# EAGLE schematic NEW MEIN (EAGLE 9.6.2)

## Sheet 1 of 6
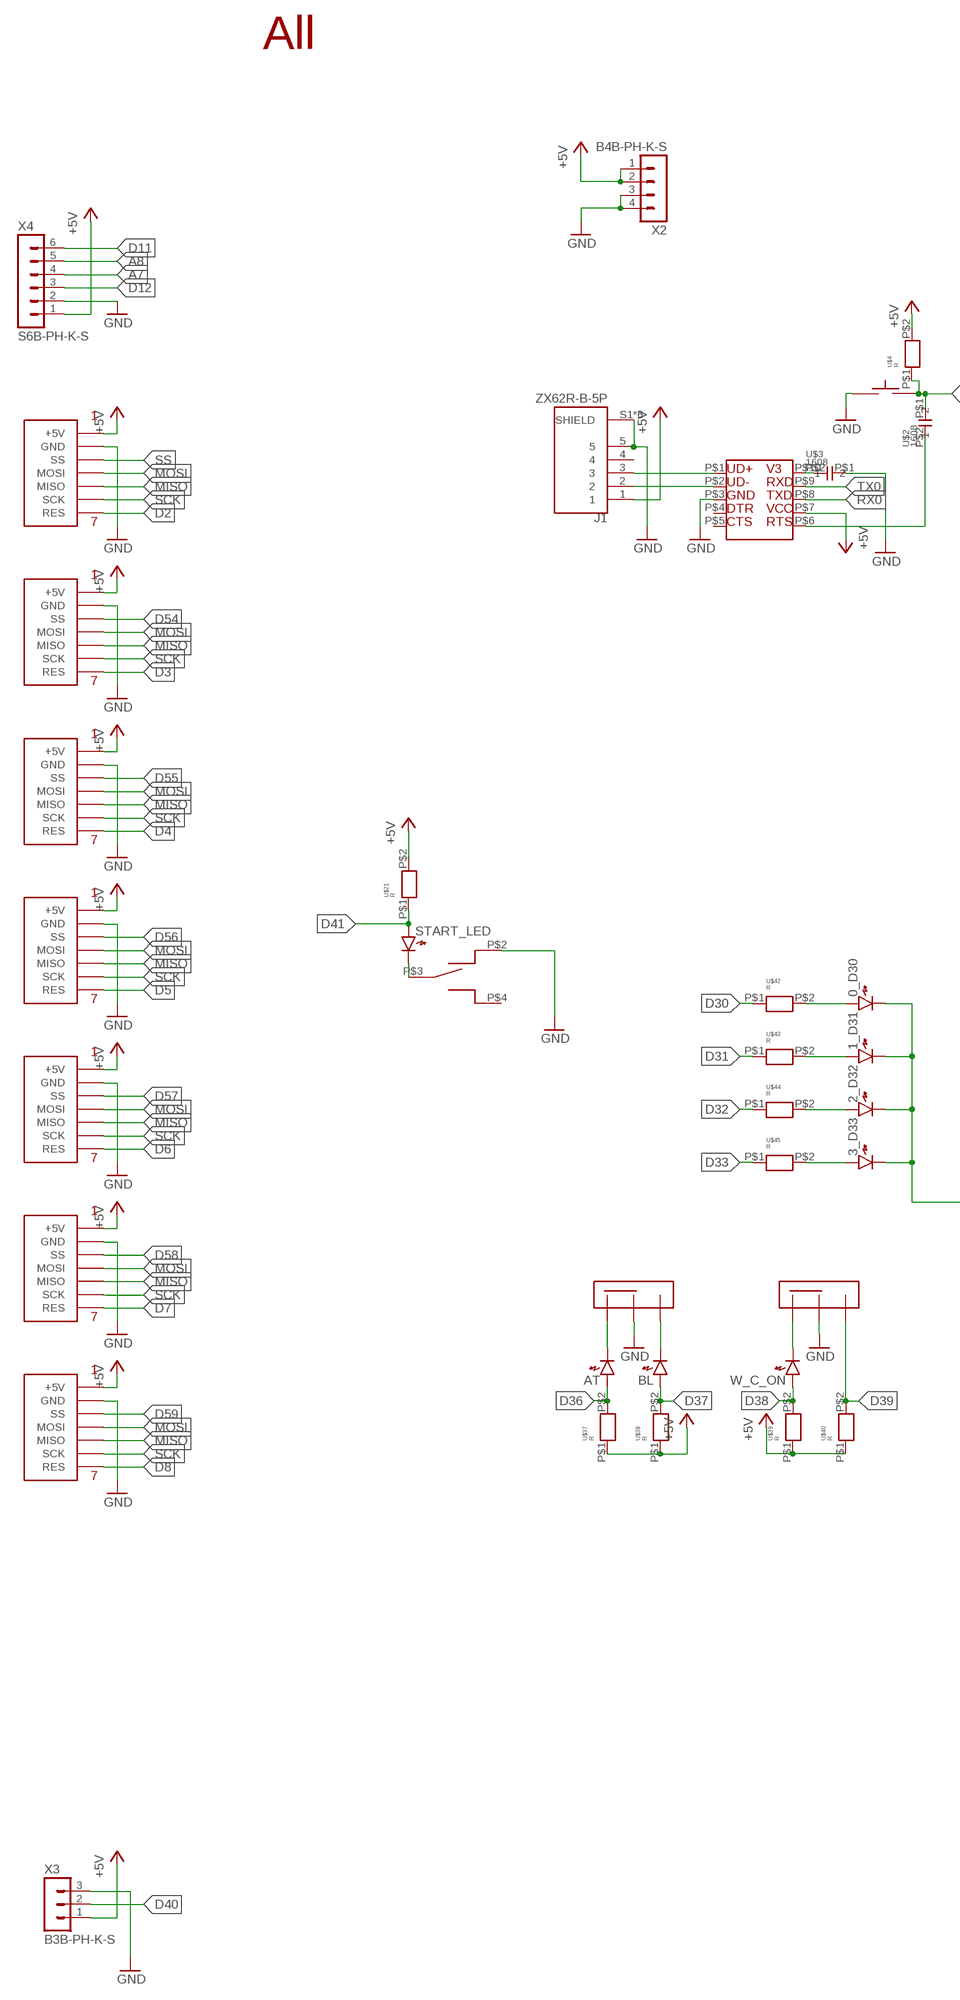
[diagram p0: schematic, sheet 1, part 1 of 2]
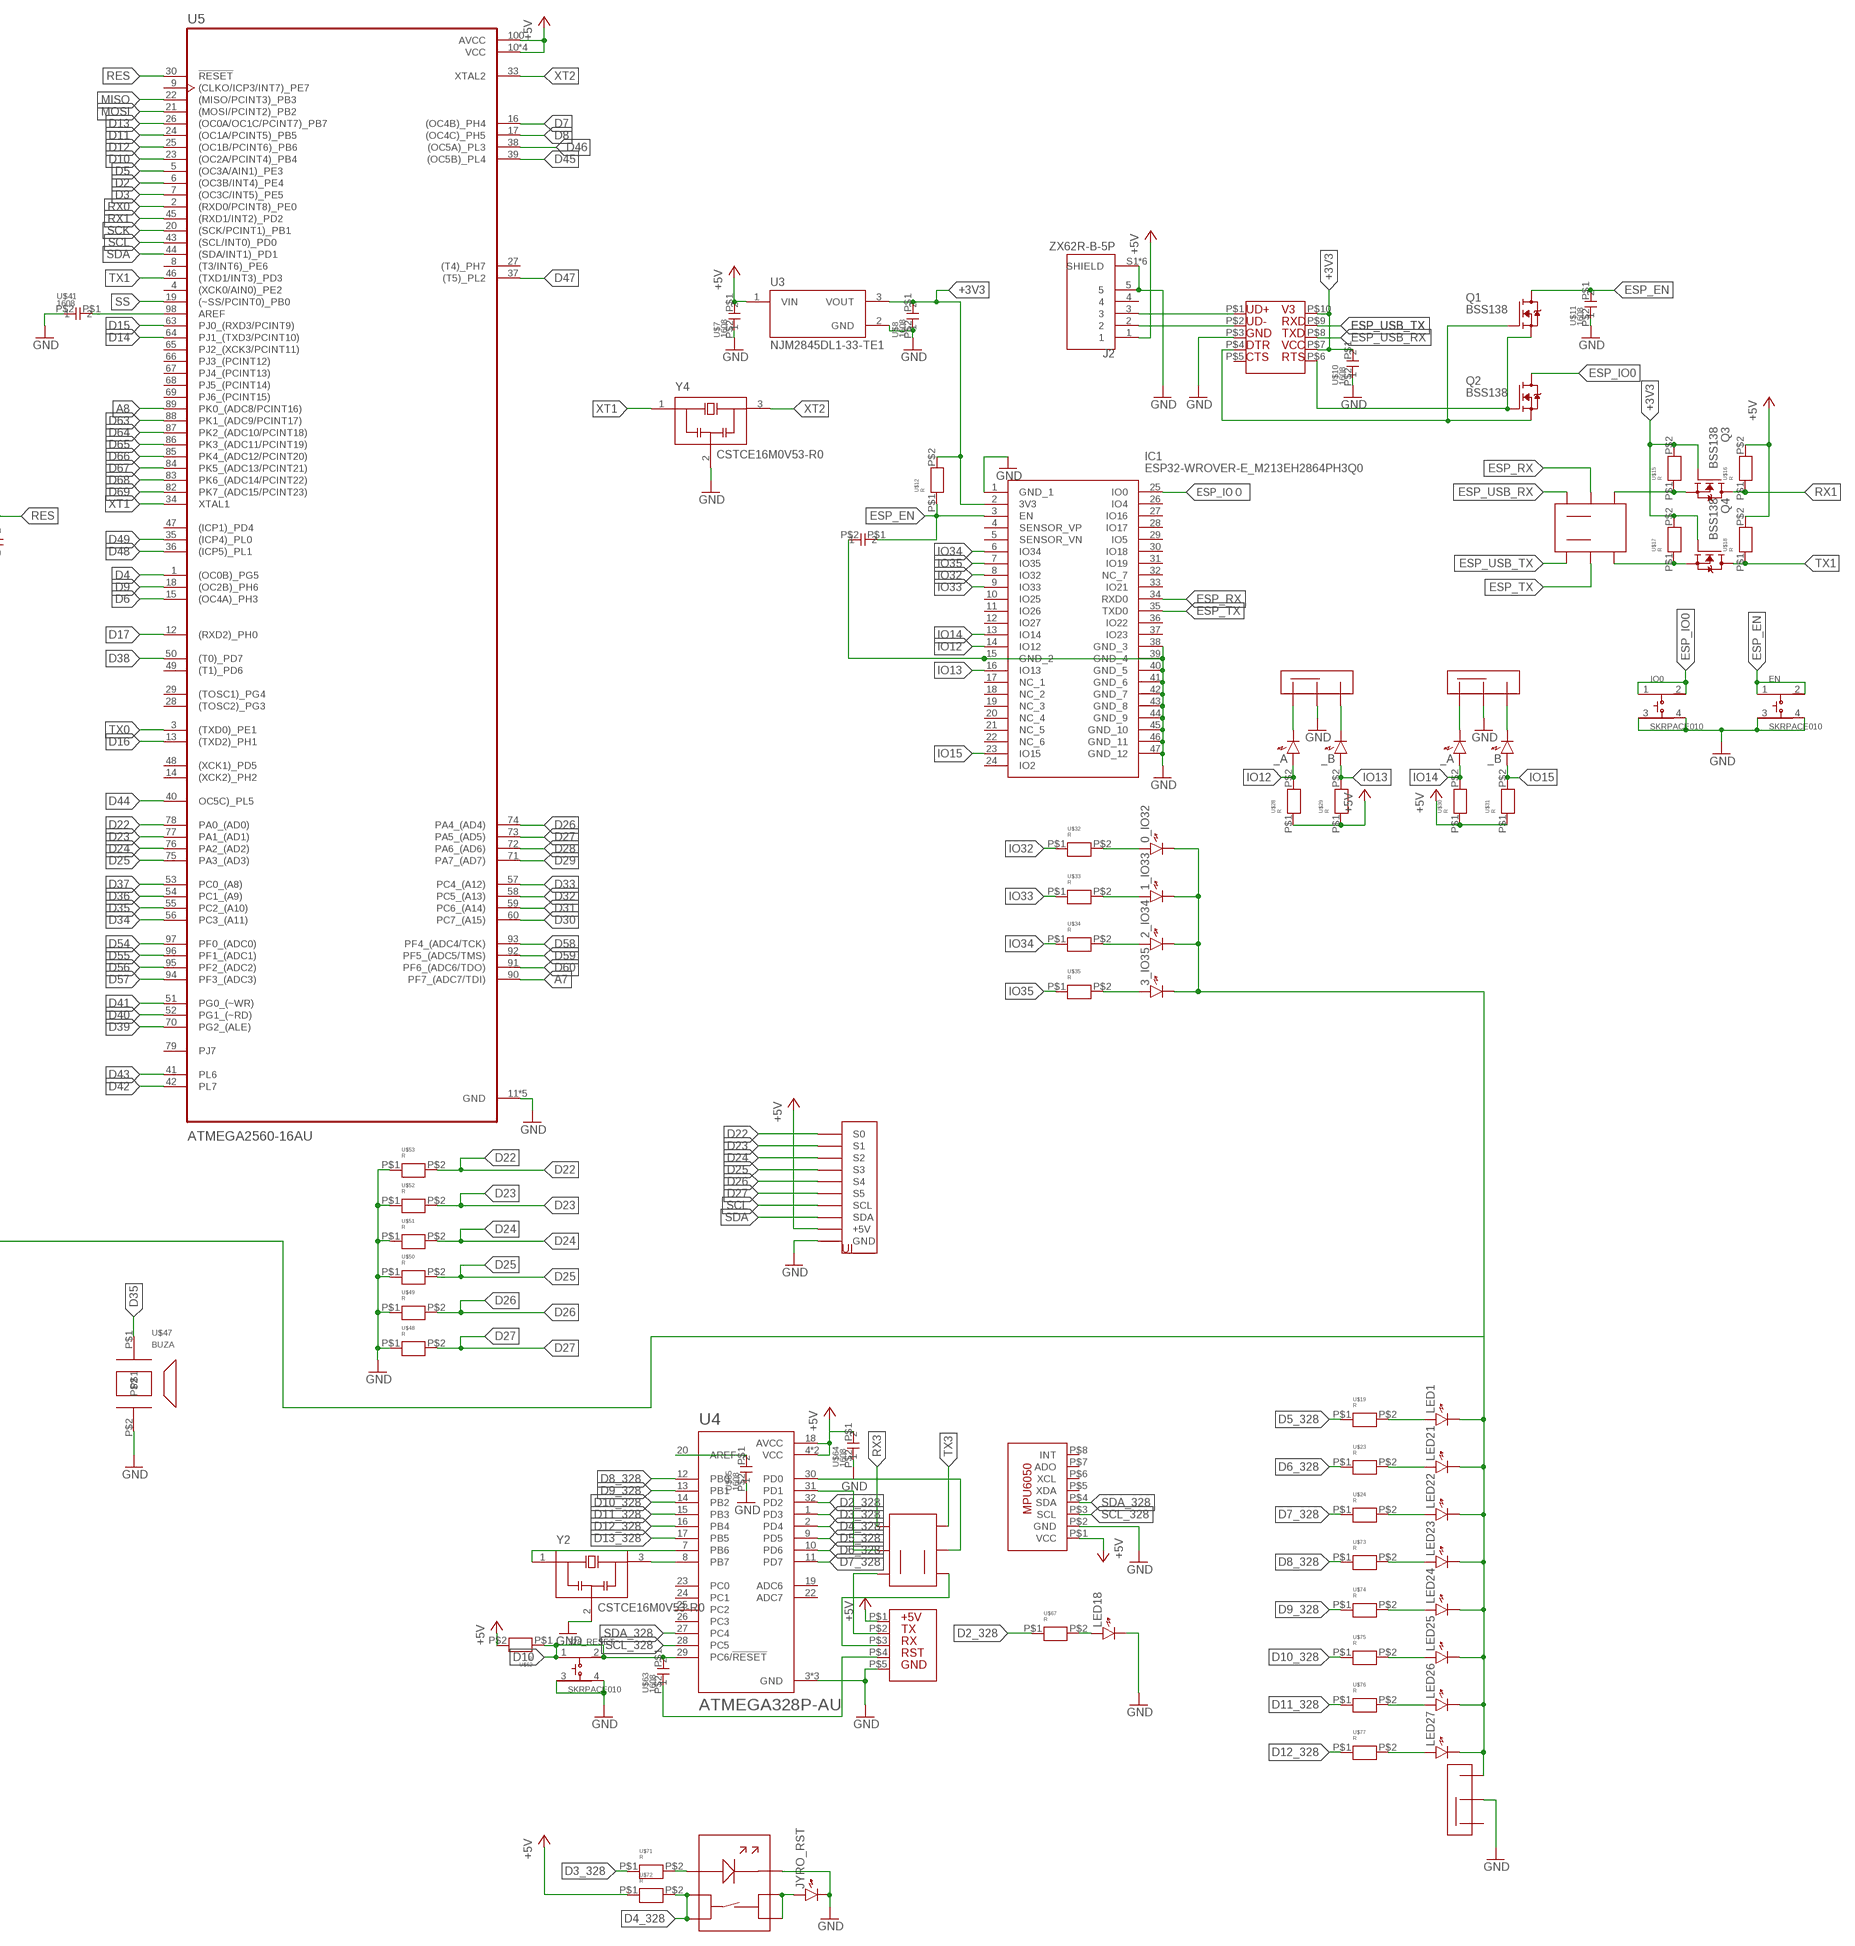
[diagram p1: schematic, sheet 1, part 2 of 2]

### Parts
0_D30  LED1608  [LED1608]
0_IO32  LED1608  [LED1608]
1_D31  LED1608  [LED1608]
1_IO33  LED1608  [LED1608]
2_D32  LED1608  [LED1608]
2_IO34  LED1608  [LED1608]
3_D33  LED1608  [LED1608]
3_IO35  LED1608  [LED1608]
328_RESET  SKRPACE010  [SW_SKRPACE010]
AT  LED1608  [LED1608]
BL  LED1608  [LED1608]
EN  SKRPACE010  [SW_SKRPACE010]
IC1  ESP32-WROVER-E_M213EH2864PH3Q0  [ESP32WROVEREM213EH2864PH3Q0]
IO0  SKRPACE010  [SW_SKRPACE010]
J1  ZX62R-B-5P  [HRS_ZX62R-B-5P]
J2  ZX62R-B-5P  [HRS_ZX62R-B-5P]
JYRO_RST  LED1608  [LED1608]
LED1  LED1608  [LED1608]
LED18  LED1608  [LED1608]
LED21  LED1608  [LED1608]
LED22  LED1608  [LED1608]
LED23  LED1608  [LED1608]
LED24  LED1608  [LED1608]
LED25  LED1608  [LED1608]
LED26  LED1608  [LED1608]
LED27  LED1608  [LED1608]
Q1  BSS138  [SOT23]
Q2  BSS138  [SOT23]
Q3  BSS138  [SOT23]
Q4  BSS138  [SOT23]
START_LED  LED1608  [LED1608]
U3  NJM2845DL1-33-TE1  [DPAK228P968X238-4N]
U4  ATMEGA328P-AU  [QFP80P900X900X120-32N]
U5  ATMEGA2560-16AU  [QFP50P1600X1600X120-100N]
U$1  CH340K  [CH340K]
U$2  1608  [CON]
U$3  1608  [CON]
U$4  R  [1608]
U$5  ALL  [ALL]
U$6  TAKUTO  [12]
U$7  1608  [CON]
U$8  1608  [CON]
U$9  CH340K  [CH340K]
U$10  1608  [CON]
U$11  1608  [CON]
U$12  R  [1608]
U$13  1608  [CON]
U$14  2SW  [2SW]
U$15  R  [1608]
U$16  R  [1608]
U$17  R  [1608]
U$18  R  [1608]
U$19  R  [1608]
U$20  S  [S]
U$21  R  [1608]
U$22  SSW  [SSW]
U$23  R  [1608]
U$24  R  [1608]
U$25  ジャイロ  [ジャイロ]
U$26  SSW  [SSW]
U$27  SSW  [SSW]
U$28  R  [1608]
U$29  R  [1608]
U$30  R  [1608]
U$31  R  [1608]
U$32  R  [1608]
U$33  R  [1608]
U$34  R  [1608]
U$35  R  [1608]
U$36  SSW  [SSW]
U$37  R  [1608]
U$38  R  [1608]
U$39  R  [1608]
U$40  R  [1608]
U$41  1608  [CON]
U$42  R  [1608]
U$43  R  [1608]
U$44  R  [1608]
U$45  R  [1608]
U$47  BUZA  [BUZA]
U$48  R  [1608]
U$49  R  [1608]
U$50  R  [1608]
U$51  R  [1608]
U$52  R  [1608]
U$53  R  [1608]
U$54  SPI  [SPI]
U$55  SPI  [SPI]
U$56  SPI  [SPI]
U$57  SPI  [SPI]
U$58  SPI  [SPI]
U$59  SPI  [SPI]
U$60  SPI  [SPI]
U$62  R  [1608]
U$63  1608  [CON]
U$64  1608  [CON]
U$65  1608  [CON]
U$66  SI  [SI]
U$67  R  [1608]
U$68  UI  [UI]
U$69  2SW  [2SW]
U$70  SWLED  [SWLED]
U$71  R  [1608]
U$72  R  [1608]
U$73  R  [1608]
U$74  R  [1608]
U$75  R  [1608]
U$76  R  [1608]
U$77  R  [1608]
U$78  SSW  [SSW]
W_C_ON  LED1608  [LED1608]
X2  B4B-PH-K-S  [B4B-PH-K-S]
X3  B3B-PH-K-S  [B3B-PH-K-S]
X4  S6B-PH-K-S  [S6B-PH-K-S]
Y2  CSTCE16M0V53-R0  [OSC_CSTCE16M0V53-R0]
Y4  CSTCE16M0V53-R0  [OSC_CSTCE16M0V53-R0]
Ⅰ_A  LED1608  [LED1608]
Ⅰ_B  LED1608  [LED1608]
Ⅱ_A  LED1608  [LED1608]
Ⅱ_B  LED1608  [LED1608]

### Nets
+3V3: IC1.2(3V3) Q3.1(G) Q4.1(G) U3.3(VOUT) U$8.P$1 U$9.P$7 U$9.P$10 U$10.P$1 U$12.P$2 U$15.P$2 U$17.P$2
+5V: J1.1 J2.1 U3.1(VIN) U4.4(VCC) U4.6(VCC) U4.18(AVCC) U5.10(VCC) U5.31(VCC) U5.61(VCC) U5.80(VCC) U5.100(AVCC) U$1.P$7 U$4.P$2 U$7.P$1 U$16.P$2 U$18.P$2 U$21.P$2 U$25.P$1(VCC) U$28.P$1 U$29.P$1 U$30.P$1 U$31.P$1 U$37.P$1 U$38.P$1 U$39.P$1 U$40.P$1 U$54.P$1(+5V) U$55.P$1(+5V) U$56.P$1(+5V) U$57.P$1(+5V) U$58.P$1(+5V) U$59.P$1(+5V) U$60.P$1(+5V) U$62.P$2 U$64.P$1 U$66.P$1 U$68.P$1(+5V) U$72.P$1 X2.1 X2.2 X3.1 X4.1
A7: U5.90(PF7_(ADC7/TDI)) X4.4
A8: U5.89(PK0_(ADC8/PCINT16)) X4.5
D2: U5.6((OC3B/INT4)_PE4) U$54.P$7(RES)
D2_328: U4.32(PD2) U$67.P$1
D3: U5.7((OC3C/INT5)_PE5) U$55.P$7(RES)
D3_328: U4.1(PD3) U$71.P$1
D4: U5.1((OC0B)_PG5) U$56.P$7(RES)
D4_328: U4.2(PD4) U$70.1 U$70.2 U$72.P$2
D5: U5.5((OC3A/AIN1)_PE3) U$57.P$7(RES)
D5_328: U4.9(PD5) U$19.P$1
D6: U5.15((OC4A)_PH3) U$58.P$7(RES)
D6_328: U4.10(PD6) U$23.P$1
D7: U5.16((OC4B)_PH4) U$59.P$7(RES)
D7_328: U4.11(PD7) U$24.P$1
D8: U5.17((OC4C)_PH5) U$60.P$7(RES)
D8_328: U4.12(PB0) U$73.P$1
D9: U5.18((OC2B)_PH6)
D9_328: U4.13(PB1) U$74.P$1
D10: 328_RESET.1 328_RESET.2 U4.29(PC6/!RESET) U5.23((OC2A/PCINT4)_PB4) U$62.P$1 U$63.P$1
D10_328: U4.14(PB2) U$75.P$1
D11: U5.24((OC1A/PCINT5)_PB5) X4.6
D11_328: U4.15(PB3) U$76.P$1
D12: U5.25((OC1B/PCINT6)_PB6) X4.3
D12_328: U4.16(PB4) U$77.P$1
D13: U5.26((OC0A/OC1C/PCINT7)_PB7)
D13_328: U4.17(PB5)
D14: U5.64(PJ1_(TXD3/PCINT10))
D15: U5.63(PJ0_(RXD3/PCINT9))
D16: U5.13((TXD2)_PH1)
D17: U5.12((RXD2)_PH0)
D22: U5.78(PA0_(AD0)) U$53.P$2 U$68.P$3(S0)
D23: U5.77(PA1_(AD1)) U$52.P$2 U$68.P$4(S1)
D24: U5.76(PA2_(AD2)) U$51.P$2 U$68.P$5(S2)
D25: U5.75(PA3_(AD3)) U$50.P$2 U$68.P$6(S3)
D26: U5.74(PA4_(AD4)) U$49.P$2 U$68.P$7(S4)
D27: U5.73(PA5_(AD5)) U$48.P$2 U$68.P$8(S5)
D28: U5.72(PA6_(AD6))
D29: U5.71(PA7_(AD7))
D30: U5.60(PC7_(A15)) U$42.P$1
D31: U5.59(PC6_(A14)) U$43.P$1
D32: U5.58(PC5_(A13)) U$44.P$1
D33: U5.57(PC4_(A12)) U$45.P$1
D34: U5.56(PC3_(A11))
D35: U5.55(PC2_(A10)) U$47.P$1
D36: AT.A U5.54(PC1_(A9)) U$37.P$2
D37: BL.A U5.53(PC0_(A8)) U$38.P$2
D38: U5.50((T0)_PD7) U$39.P$2 W_C_ON.A
D39: U5.70(PG2_(ALE)) U$36.P$2 U$40.P$2
D40: U5.52(PG1_(~RD)) X3.2
D41: START_LED.A U5.51(PG0_(~WR)) U$21.P$1
D42: U5.42(PL7)
D43: U5.41(PL6)
D44: U5.40(OC5C)_PL5)
D45: U5.39((OC5B)_PL4)
D46: U5.38((OC5A)_PL3)
D47: U5.37((T5)_PL2)
D48: U5.36((ICP5)_PL1)
D49: U5.35((ICP4)_PL0)
D54: U5.97(PF0_(ADC0)) U$55.P$3(SS)
D55: U5.96(PF1_(ADC1)) U$56.P$3(SS)
D56: U5.95(PF2_(ADC2)) U$57.P$3(SS)
D57: U5.94(PF3_(ADC3)) U$58.P$3(SS)
D58: U5.93(PF4_(ADC4/TCK)) U$59.P$3(SS)
D59: U5.92(PF5_(ADC5/TMS)) U$60.P$3(SS)
D60: U5.91(PF6_(ADC6/TDO))
D63: U5.88(PK1_(ADC9/PCINT17))
D64: U5.87(PK2_(ADC10/PCINT18))
D65: U5.86(PK3_(ADC11/PCINT19))
D66: U5.85(PK4_(ADC12/PCINT20))
D67: U5.84(PK5_(ADC13/PCINT21))
D68: U5.83(PK6_(ADC14/PCINT22))
D69: U5.82(PK7_(ADC15/PCINT23))
ESP_EN: EN.1 EN.2 IC1.3(EN) Q1.3(D) U$11.P$1 U$12.P$1 U$13.P$1
ESP_IO0: IO0.1 IO0.2 Q2.3(D)
ESP_IO０: IC1.25(IO0)
ESP_RX: IC1.34(RXD0) U$14.P$2
ESP_TX: IC1.35(TXD0) U$14.P$5
ESP_USB_RX: U$9.P$8 U$14.P$1
ESP_USB_TX: U$9.P$9 U$14.P$6
GND: 328_RESET.3 328_RESET.4 EN.3 EN.4 IC1.1(GND_1) IC1.15(GND_2) IC1.38(GND_3) IC1.39(GND_4) IC1.40(GND_5) IC1.41(GND_6) IC1.42(GND_7) IC1.43(GND_8) IC1.44(GND_9) IC1.45(GND_10) IC1.46(GND_11) IC1.47(GND_12) IO0.3 IO0.4 J1.5 J1.S1(SHIELD) J1.S2(SHIELD) J1.S3(SHIELD) J1.S4(SHIELD) J1.S5(SHIELD) J1.S6(SHIELD) J2.5 J2.S1(SHIELD) J2.S2(SHIELD) J2.S3(SHIELD) J2.S4(SHIELD) J2.S5(SHIELD) J2.S6(SHIELD) JYRO_RST.K LED18.K U3.2(GND) U4.3(GND) U4.5(GND) U4.21(GND) U5.11(GND) U5.32(GND) U5.62(GND) U5.81(GND) U5.99(GND) U$1.P$3 U$3.P$1 U$6.P$1 U$6.P$4 U$7.P$2 U$8.P$2 U$9.P$3 U$10.P$2 U$11.P$2 U$13.P$2 U$20.P$2 U$22.P$3 U$25.P$2(GND) U$26.P$3 U$27.P$3 U$36.P$3 U$41.P$2 U$47.P$2 U$48.P$1 U$49.P$1 U$50.P$1 U$51.P$1 U$52.P$1 U$53.P$1 U$54.P$2(GND) U$55.P$2(GND) U$56.P$2(GND) U$57.P$2(GND) U$58.P$2(GND) U$59.P$2(GND) U$60.P$2(GND) U$64.P$2 U$65.P$2 U$66.P$5 U$68.P$2(GND) U$70.-(LED-) U$78.P$3 X2.3 X2.4 X3.3 X4.2 Y2.2(GND) Y4.2(GND)
IO12: IC1.14(IO12) U$28.P$2 Ⅰ_A.A
IO13: IC1.16(IO13) U$29.P$2 Ⅰ_B.A
IO14: IC1.13(IO14) U$30.P$2 Ⅱ_A.A
IO15: IC1.23(IO15) U$31.P$2 Ⅱ_B.A
IO32: IC1.8(IO32) U$32.P$1
IO33: IC1.9(IO33) U$33.P$1
IO34: IC1.6(IO34) U$34.P$1
IO35: IC1.7(IO35) U$35.P$1
MISO: U5.22((MISO/PCINT3)_PB3) U$54.P$5(MISO) U$55.P$5(MISO) U$56.P$5(MISO) U$57.P$5(MISO) U$58.P$5(MISO) U$59.P$5(MISO) U$60.P$5(MISO)
MOSI: U5.21((MOSI/PCINT2)_PB2) U$54.P$4(MOSI) U$55.P$4(MOSI) U$56.P$4(MOSI) U$57.P$4(MOSI) U$58.P$4(MOSI) U$59.P$4(MOSI) U$60.P$4(MOSI)
N$1: U$1.P$6 U$2.P$2
N$5: U4.20(AREF) U$65.P$1
N$7: U5.98(AREF) U$41.P$1
N$9: J1.2 U$1.P$2
N$10: J1.3 U$1.P$1
N$11: LED1.A U$19.P$2
N$12: 0_D30.K 0_IO32.K 1_D31.K 1_IO33.K 2_D32.K 2_IO34.K 3_D33.K 3_IO35.K LED1.K LED21.K LED22.K LED23.K LED24.K LED25.K LED26.K LED27.K U$78.P$2
N$13: LED21.A U$23.P$2
N$14: U$1.P$10 U$3.P$2
N$15: START_LED.K U$20.P$3
N$16: U$63.P$2 U$66.P$4
N$17: Q1.1(G) Q2.2(S) U$9.P$4
N$18: Q1.2(S) Q2.1(G) U$9.P$6
N$19: AT.K U$22.P$1
N$20: BL.K U$22.P$2
N$21: U4.31(PD1) U$69.P$2
N$22: J2.2 U$9.P$2
N$23: J2.3 U$9.P$1
N$24: U$26.P$1 Ⅰ_A.K
N$25: U$26.P$2 Ⅰ_B.K
N$26: U$66.P$3 U$69.P$6
N$27: U$27.P$1 Ⅱ_A.K
N$28: U$27.P$2 Ⅱ_B.K
N$29: U4.8(PB7) Y2.3(OUT)
N$30: U4.7(PB6) Y2.1(IN)
N$31: U$36.P$1 W_C_ON.K
N$33: 0_D30.A U$42.P$2
N$34: 0_IO32.A U$32.P$2
N$35: 1_IO33.A U$33.P$2
N$36: 2_IO34.A U$34.P$2
N$37: 3_IO35.A U$35.P$2
N$38: LED18.A U$67.P$2
N$39: U$66.P$2 U$69.P$1
N$40: U4.30(PD0) U$69.P$5
N$42: 1_D31.A U$43.P$2
N$43: 2_D32.A U$44.P$2
N$44: 3_D33.A U$45.P$2
N$46: JYRO_RST.A U$70.3 U$70.4
N$47: U$70.+(LED+) U$71.P$2
N$48: LED22.A U$24.P$2
N$49: LED23.A U$73.P$2
N$51: LED24.A U$74.P$2
N$52: LED25.A U$75.P$2
N$53: LED26.A U$76.P$2
N$54: LED27.A U$77.P$2
RES: U5.30(!RESET) U$2.P$1 U$4.P$1 U$6.P$2 U$6.P$3
RX0: U5.2((RXD0/PCINT8)_PE0) U$1.P$8
RX1: Q3.2(S) Q3.3(D) U5.45((RXD1/INT2)_PD2) U$14.P$3 U$15.P$1 U$16.P$1
RX3: U$69.P$3
SCK [New Class]: U5.20((SCK/PCINT1)_PB1) U$54.P$6(SCK) U$55.P$6(SCK) U$56.P$6(SCK) U$57.P$6(SCK) U$58.P$6(SCK) U$59.P$6(SCK) U$60.P$6(SCK)
SCL: U5.43((SCL/INT0)_PD0) U$68.P$9(SCL)
SCL_328: U4.28(PC5) U$25.P$3(SCL)
SDA: U5.44((SDA/INT1)_PD1) U$68.P$10(SDA)
SDA_328: U4.27(PC4) U$25.P$4(SDA)
SS: U5.19((~SS/PCINT0)_PB0) U$54.P$3(SS)
TX0: U5.3((TXD0)_PE1) U$1.P$9
TX1: Q4.2(S) Q4.3(D) U5.46((TXD1/INT3)_PD3) U$14.P$4 U$17.P$1 U$18.P$1
TX3: U$69.P$4
XT1: U5.34(XTAL1) Y4.1(IN)
XT2: U5.33(XTAL2) Y4.3(OUT)
Unconnected: IC1.4(SENSOR_VP) IC1.5(SENSOR_VN) IC1.10(IO25) IC1.11(IO26) IC1.12(IO27) IC1.17(NC_1) IC1.18(NC_2) IC1.19(NC_3) IC1.20(NC_4) IC1.21(NC_5) IC1.22(NC_6) IC1.24(IO2) IC1.26(IO4) IC1.27(IO16) IC1.28(IO17) IC1.29(IO5) IC1.30(IO18) IC1.31(IO19) IC1.32(NC_7) IC1.33(IO21) IC1.36(IO22) IC1.37(IO23) J1.4 J2.4 U4.19(ADC6) U4.22(ADC7) U4.23(PC0) U4.24(PC1) U4.25(PC2) U4.26(PC3) U5.4((XCK0/AIN0)_PE2) U5.8((T3/INT6)_PE6) U5.9((CLKO/ICP3/INT7)_PE7) U5.14((XCK2)_PH2) U5.27((T4)_PH7) U5.28((TOSC2)_PG3) U5.29((TOSC1)_PG4) U5.47((ICP1)_PD4) U5.48((XCK1)_PD5) U5.49((T1)_PD6) U5.65(PJ2_(XCK3/PCINT11)) U5.66(PJ3_(PCINT12)) U5.67(PJ4_(PCINT13)) U5.68(PJ5_(PCINT14)) U5.69(PJ6_(PCINT15)) U5.79(PJ7) U$1.P$4 U$1.P$5 U$9.P$5 U$20.P$4 U$25.P$5(XDA) U$25.P$6(XCL) U$25.P$7(ADO) U$25.P$8(INT) U$78.P$1

## Sheet 2 of 6

## Sheet 3 of 6

## Sheet 4 of 6

## Sheet 5 of 6

## Sheet 6 of 6

## Library data of the parts
0_D30 0_IO32 1_D31 1_IO33 2_D32 2_IO34 3_D33 3_IO35 AT BL JYRO_RST LED1 LED18 LED21-LED27 START_LED W_C_ON Ⅰ_A Ⅰ_B Ⅱ_A Ⅱ_B = generic:LED: Generic LEDs
328_RESET EN IO0 = SKRPACE010:SKRPACE010: Switch Tactile N.O. SPST Button J-Bend 0.05A 16VDC 2.55N SMD Automotive T/R Check prices <https://pricing.snapeda.com/parts/SKRPACE010/ALPS/view-part?ref=eda>; AVAILABILITY: In Stock; DESCRIPTION: Switch Tactile N.O. SPST Button J-Bend 0.05A 16VDC 2.55N SMD Automotive T/R; MF: ALPS; MP: SKRPACE010; PACKAGE: None; PRICE: None
IC1 = ESP32:ESP32-WROVER-E_M213EH2864PH3Q0: WiFi Modules (802.11) SMD Module ESP32-D0WD-V3, 3.3V 64Mbit PSRAM, 16 MB SPI flash, PCB Antenna Source: Datasheet <https://www.mouser.in/datasheet/2/891/esp32-wrover-e_esp32-wrover-ie_datasheet_en-1855913.pdf>; DESCRIPTION: WiFi Modules (802.11) SMD Module ESP32-D0WD-V3, 3.3V 64Mbit PSRAM, 16 MB SPI flash, PCB Antenna; HEIGHT: 3.45mm; MANUFACTURER_NAME: Espressif Systems; MANUFACTURER_PART_NUMBER: ESP32-WROVER-E(M213EH2864PH3Q0); MOUSER_PART_NUMBER: 356-ESP32WRVE22864PC; MOUSER_PRICE-STOCK: https://www.mouser.co.uk/ProductDetail/Espressif-Systems/ESP32-WROVER-EM213EH2864PH3Q0?qs=vmHwEFxEFR8kG00CaGIvFQ%3D%3D
J1 J2 = USBMicro:ZX62R-B-5P: Conn Micro USB 2.0 Type B RCP 5 POS 0.65mm Solder RA SMD 5 Terminal 1 Port Embossed T/R Check prices <https://pricing.snapeda.com/parts/ZX62R-B-5P/Hirose/view-part?ref=eda>; AVAILABILITY: In Stock; DESCRIPTION: USB - micro B USB 2.0 Receptacle Connector 5 Position Surface Mount, Right Angle; MF: Hirose; MP: ZX62R-B-5P; PACKAGE: None; PRICE: None
Q1-Q4 = bss138_10:BSS138: BSS138 N-Channel Logic Level Enhancement Mode Field Effect Transistor Source: http://www.fairchildsemi.com/datasheets/BS/BSS138.pdf; MF: Fairchild; MPN: BSS138; OC_FARNELL: 9845330; OC_NEWARK: 67R2009
U3 = NJM2845DL1-33-TE1:NJM2845DL1-33-TE1: NJM2845 Series 800 mA 3.3 V Fixed Output SMT LDO Regulator - TO-252 Check prices <https://pricing.snapeda.com/parts/NJM2845DL1-33-TE1/NJR%20Corporation/NJRC/view-part?ref=eda>; AVAILABILITY: Not in stock; DESCRIPTION: Linear Voltage Regulator IC Positive Fixed 1 Output 800mA TO-252-3; MF: NJR Corporation/NJRC; MP: NJM2845DL1-33-TE1; PACKAGE: TO-252-3 New Japan Radio; PRICE: None
U4 = ATMEGA328P-AU:ATMEGA328P-AU: ATmega Series 20 MHz 32 KB Flash 2 KB SRAM 8-Bit Microcontroller - TQFP-32 Check prices <https://pricing.snapeda.com/parts/ATMEGA328P-AU/Microchip%20Technology/view-part?ref=eda>; AVAILABILITY: In Stock; DESCRIPTION: AVR AVR® ATmega Microcontroller IC 8-Bit 20MHz 32KB (16K x 16) FLASH 32-TQFP (7x7); MF: Microchip Technology; MP: ATMEGA328P-AU; PACKAGE: TQFP-32 Microchip; PRICE: None
U5 = ATMEGA2560-16AU (1):ATMEGA2560-16AU: Check prices <https://pricing.snapeda.com/parts/ATMEGA2560-16AU/Microchip%20Technology/view-part?ref=eda>; AVAILABILITY: In Stock; DESCRIPTION: AVR AVR® ATmega Microcontroller IC 8-Bit 16MHz 256KB (128K x 16) FLASH 100-TQFP (14x14); MF: Microchip Technology; MP: ATMEGA2560-16AU; PACKAGE: None; PRICE: None; PURCHASE-URL: https://pricing.snapeda.com/search/part/ATMEGA2560-16AU/?ref=eda
U$1 U$9 = CH340K:CH340K
U$2 U$3 U$7 U$8 U$10 U$11 U$13 U$41 U$63-U$65 = con1608:1608
U$4 U$12 U$15-U$19 U$21 U$23 U$24 U$28-U$35 U$37-U$40 U$42-U$45 U$48-U$53 U$62 U$67 U$71-U$77 = R 1608:R
U$5 = All_outlook:ALL
U$6 = タクト:TAKUTO
U$14 U$69 = 2SW:2SW
U$20 = トグル:S
U$22 U$26 U$27 U$36 U$78 = SSW:SSW
U$25 = ジャイロセンサ:ジャイロ
U$47 = 圧電スピーカー:BUZA
U$54-U$60 = SPI用PH7ピン:SPI
U$66 = プログラム入力:SI
U$68 = UI:UI
U$70 = SW_LED:SWLED
X2 = con-JST PH:B4B-PH: JST PH series header 2.00mm pitch disconnectable crimp style connectors, vertical (side entry type), 4 pins
X3 = con-JST PH:B3B-PH: JST PH series header 2.00mm pitch disconnectable crimp style connectors, vertical (side entry type), 3 pins
X4 = con-JST PH:S6B-PH: JST PH series header 2.00mm pitch disconnectable crimp style connectors, horizontal (side entry type), 6 pins
Y2 Y4 = CSTCE16M0V53-R0:CSTCE16M0V53-R0: 20MHz Ceramic Resonator Built in Capacitor 15pF +/- 0.2% -40C - 125C Surface Mount; MANUFACTURER: Murata; MAXIMUM_PACKAGE_HEIGHT: 1.00mm; PARTREV: May 7, 2019; STANDARD: Manufacturer Recommendations